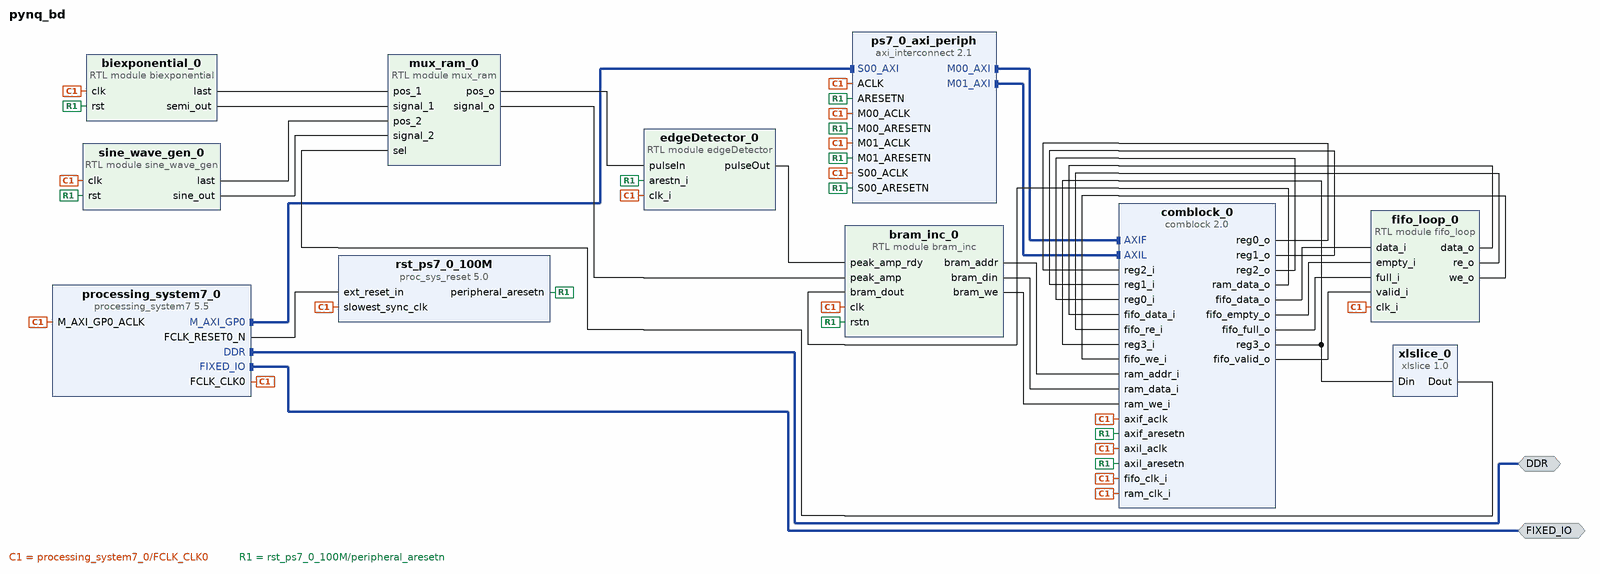
[diagram p0: block diagram of the top level]
# Vivado block design pynq_bd, xc7z020clg400-1, Vivado 2022.2
create_bd_design pynq_bd

create_bd_intf_port -mode Master -vlnv xilinx.com:interface:ddrx_rtl:1.0 DDR
create_bd_intf_port -mode Master -vlnv xilinx.com:display_processing_system7:fixedio_rtl:1.0 FIXED_IO

create_bd_cell -type ip -vlnv xilinx.com:ip:processing_system7:5.5 processing_system7_0
set_property -dict [list \
  CONFIG.PCW_APU_PERIPHERAL_FREQMHZ 650 \
  CONFIG.PCW_CRYSTAL_PERIPHERAL_FREQMHZ 50 \
  CONFIG.PCW_ENET0_ENET0_IO {MIO 16 .. 27} \
  CONFIG.PCW_ENET0_GRP_MDIO_ENABLE 1 \
  CONFIG.PCW_ENET0_GRP_MDIO_IO {MIO 52 .. 53} \
  CONFIG.PCW_ENET0_PERIPHERAL_ENABLE 1 \
  CONFIG.PCW_ENET0_RESET_ENABLE 1 \
  CONFIG.PCW_ENET0_RESET_IO {MIO 9} \
  CONFIG.PCW_ENET_RESET_ENABLE 1 \
  CONFIG.PCW_ENET_RESET_SELECT {Share reset pin} \
  CONFIG.PCW_FPGA0_PERIPHERAL_FREQMHZ 100 \
  CONFIG.PCW_FPGA1_PERIPHERAL_FREQMHZ 50 \
  CONFIG.PCW_GPIO_MIO_GPIO_ENABLE 1 \
  CONFIG.PCW_GPIO_MIO_GPIO_IO MIO \
  CONFIG.PCW_I2C_RESET_ENABLE 1 \
  CONFIG.PCW_M_AXI_GP0_FREQMHZ 10 \
  CONFIG.PCW_PERIPHERAL_BOARD_PRESET part0 \
  CONFIG.PCW_PRESET_BANK1_VOLTAGE {LVCMOS 1.8V} \
  CONFIG.PCW_QSPI_GRP_FBCLK_ENABLE 1 \
  CONFIG.PCW_QSPI_GRP_FBCLK_IO {MIO 8} \
  CONFIG.PCW_QSPI_GRP_SINGLE_SS_ENABLE 1 \
  CONFIG.PCW_QSPI_GRP_SINGLE_SS_IO {MIO 1 .. 6} \
  CONFIG.PCW_QSPI_PERIPHERAL_ENABLE 1 \
  CONFIG.PCW_QSPI_QSPI_IO {MIO 1 .. 6} \
  CONFIG.PCW_SD0_GRP_CD_ENABLE 1 \
  CONFIG.PCW_SD0_GRP_CD_IO {MIO 47} \
  CONFIG.PCW_SD0_GRP_WP_ENABLE 0 \
  CONFIG.PCW_SD0_PERIPHERAL_ENABLE 1 \
  CONFIG.PCW_SD0_SD0_IO {MIO 40 .. 45} \
  CONFIG.PCW_SDIO_PERIPHERAL_FREQMHZ 50 \
  CONFIG.PCW_SINGLE_QSPI_DATA_MODE x4 \
  CONFIG.PCW_UART0_PERIPHERAL_ENABLE 1 \
  CONFIG.PCW_UART0_UART0_IO {MIO 14 .. 15} \
  CONFIG.PCW_UART1_PERIPHERAL_ENABLE 0 \
  CONFIG.PCW_UART_PERIPHERAL_FREQMHZ 100 \
  CONFIG.PCW_UIPARAM_DDR_BUS_WIDTH {16 Bit} \
  CONFIG.PCW_UIPARAM_DDR_FREQ_MHZ 525 \
  CONFIG.PCW_UIPARAM_DDR_PARTNO {MT41J256M16 RE-125} \
  CONFIG.PCW_USB0_PERIPHERAL_ENABLE 1 \
  CONFIG.PCW_USB0_RESET_ENABLE 1 \
  CONFIG.PCW_USB0_RESET_IO {MIO 46} \
  CONFIG.PCW_USB0_USB0_IO {MIO 28 .. 39} \
  CONFIG.PCW_USB_RESET_ENABLE 1 \
  CONFIG.PCW_USB_RESET_SELECT {Share reset pin} \
] [get_bd_cells processing_system7_0]
# 486 more settings of processing_system7_0 are not shown: defaults, MIO pin electricals, DDR timing, and values the tool derives
create_bd_cell -type ip -vlnv www.ictp.it:user:comblock:2.0 comblock_0
set_property -dict [list \
  CONFIG.DRAM_IO_AWIDTH 11 \
  CONFIG.DRAM_IO_DEPTH 1024 \
  CONFIG.DRAM_IO_DWIDTH 32 \
  CONFIG.DRAM_IO_ENA true \
  CONFIG.FIFO_IN_DEPTH 64 \
  CONFIG.FIFO_IN_DWIDTH 32 \
  CONFIG.FIFO_OUT_DEPTH 64 \
  CONFIG.FIFO_OUT_DWIDTH 32 \
  CONFIG.FIFO_OUT_ENA true \
  CONFIG.REGS_IN_DEPTH 4 \
  CONFIG.REGS_OUT_DEPTH 4 \
] [get_bd_cells comblock_0]
create_bd_cell -type ip -vlnv xilinx.com:ip:axi_interconnect:2.1 ps7_0_axi_periph
create_bd_cell -type ip -vlnv xilinx.com:ip:proc_sys_reset:5.0 rst_ps7_0_100M
create_bd_cell -type module -reference fifo_loop fifo_loop_0
create_bd_cell -type ip -vlnv xilinx.com:ip:xlslice:1.0 xlslice_0
set_property -dict {CONFIG.DIN_FROM 1} [get_bd_cells xlslice_0]
create_bd_cell -type module -reference bram_inc bram_inc_0
set_property -dict {CONFIG.BRAM_ADDRESS_SIZE 11} [get_bd_cells bram_inc_0]
create_bd_cell -type module -reference mux_ram mux_ram_0
create_bd_cell -type module -reference edgeDetector edgeDetector_0
create_bd_cell -type module -reference biexponential biexponential_0
create_bd_cell -type module -reference sine_wave_gen sine_wave_gen_0

# ---- connections ----

connect_bd_intf_net [get_bd_intf_ports DDR] [get_bd_intf_pins processing_system7_0/DDR]
connect_bd_intf_net [get_bd_intf_ports FIXED_IO] [get_bd_intf_pins processing_system7_0/FIXED_IO]
connect_bd_intf_net [get_bd_intf_pins processing_system7_0/M_AXI_GP0] [get_bd_intf_pins ps7_0_axi_periph/S00_AXI]
connect_bd_intf_net [get_bd_intf_pins ps7_0_axi_periph/M00_AXI] [get_bd_intf_pins comblock_0/AXIF]
connect_bd_intf_net [get_bd_intf_pins ps7_0_axi_periph/M01_AXI] [get_bd_intf_pins comblock_0/AXIL]
connect_bd_net [get_bd_pins biexponential_0/last] [get_bd_pins mux_ram_0/pos_1]
connect_bd_net [get_bd_pins biexponential_0/semi_out] [get_bd_pins mux_ram_0/signal_1]
connect_bd_net [get_bd_pins bram_inc_0/bram_addr] [get_bd_pins comblock_0/ram_addr_i]
connect_bd_net [get_bd_pins bram_inc_0/bram_din] [get_bd_pins comblock_0/ram_data_i]
connect_bd_net [get_bd_pins bram_inc_0/bram_we] [get_bd_pins comblock_0/ram_we_i]
connect_bd_net [get_bd_pins comblock_0/fifo_data_o] [get_bd_pins fifo_loop_0/data_i]
connect_bd_net [get_bd_pins comblock_0/fifo_empty_o] [get_bd_pins fifo_loop_0/empty_i]
connect_bd_net [get_bd_pins comblock_0/fifo_full_o] [get_bd_pins fifo_loop_0/full_i]
connect_bd_net [get_bd_pins comblock_0/fifo_valid_o] [get_bd_pins fifo_loop_0/valid_i]
connect_bd_net [get_bd_pins comblock_0/ram_data_o] [get_bd_pins bram_inc_0/bram_dout]
connect_bd_net [get_bd_pins comblock_0/reg0_o] [get_bd_pins comblock_0/reg2_i]
connect_bd_net [get_bd_pins comblock_0/reg1_o] [get_bd_pins comblock_0/reg1_i]
connect_bd_net [get_bd_pins comblock_0/reg2_o] [get_bd_pins comblock_0/reg0_i]
connect_bd_net [get_bd_pins comblock_0/reg3_o] [get_bd_pins xlslice_0/Din] [get_bd_pins comblock_0/reg3_i]
connect_bd_net [get_bd_pins edgeDetector_0/pulseOut] [get_bd_pins bram_inc_0/peak_amp_rdy]
connect_bd_net [get_bd_pins fifo_loop_0/data_o] [get_bd_pins comblock_0/fifo_data_i]
connect_bd_net [get_bd_pins fifo_loop_0/re_o] [get_bd_pins comblock_0/fifo_re_i]
connect_bd_net [get_bd_pins fifo_loop_0/we_o] [get_bd_pins comblock_0/fifo_we_i]
connect_bd_net [get_bd_pins mux_ram_0/pos_o] [get_bd_pins edgeDetector_0/pulseIn]
connect_bd_net [get_bd_pins mux_ram_0/signal_o] [get_bd_pins bram_inc_0/peak_amp]
connect_bd_net [get_bd_pins processing_system7_0/FCLK_CLK0] \
  [get_bd_pins processing_system7_0/M_AXI_GP0_ACLK] [get_bd_pins ps7_0_axi_periph/ACLK] \
  [get_bd_pins ps7_0_axi_periph/S00_ACLK] [get_bd_pins rst_ps7_0_100M/slowest_sync_clk] [get_bd_pins comblock_0/axif_aclk] \
  [get_bd_pins ps7_0_axi_periph/M00_ACLK] [get_bd_pins comblock_0/axil_aclk] [get_bd_pins ps7_0_axi_periph/M01_ACLK] \
  [get_bd_pins comblock_0/ram_clk_i] [get_bd_pins comblock_0/fifo_clk_i] [get_bd_pins fifo_loop_0/clk_i] \
  [get_bd_pins bram_inc_0/clk] [get_bd_pins edgeDetector_0/clk_i] [get_bd_pins biexponential_0/clk] \
  [get_bd_pins sine_wave_gen_0/clk]
connect_bd_net [get_bd_pins processing_system7_0/FCLK_RESET0_N] [get_bd_pins rst_ps7_0_100M/ext_reset_in]
connect_bd_net [get_bd_pins rst_ps7_0_100M/peripheral_aresetn] \
  [get_bd_pins ps7_0_axi_periph/S00_ARESETN] [get_bd_pins comblock_0/axif_aresetn] [get_bd_pins ps7_0_axi_periph/M00_ARESETN] \
  [get_bd_pins ps7_0_axi_periph/ARESETN] [get_bd_pins comblock_0/axil_aresetn] [get_bd_pins ps7_0_axi_periph/M01_ARESETN] \
  [get_bd_pins bram_inc_0/rstn] [get_bd_pins edgeDetector_0/arestn_i] [get_bd_pins biexponential_0/rst] \
  [get_bd_pins sine_wave_gen_0/rst]
connect_bd_net [get_bd_pins sine_wave_gen_0/last] [get_bd_pins mux_ram_0/pos_2]
connect_bd_net [get_bd_pins sine_wave_gen_0/sine_out] [get_bd_pins mux_ram_0/signal_2]
connect_bd_net [get_bd_pins xlslice_0/Dout] [get_bd_pins mux_ram_0/sel]
set_property PFM.AXI_PORT {M_AXI_GP1 {memport "M_AXI_GP" sptag "" memory "" is_range "false"} S_AXI_HP0 {memport "S_AXI_HP" sptag "" memory "" is_range "false"}} [get_bd_cells processing_system7_0]
set_property PFM.CLOCK {FCLK_CLK0 {id "0" is_default "true" proc_sys_reset "/rst_ps7_0_100M" status "fixed" freq_hz "100000000"}} [get_bd_cells processing_system7_0]

# ---- address map ----
assign_bd_address -offset 0x43C00000 -range 256K -target_address_space [get_bd_addr_spaces processing_system7_0/Data] [get_bd_addr_segs comblock_0/AXIF/AXIF]
assign_bd_address -offset 0x43C40000 -range 64K -target_address_space [get_bd_addr_spaces processing_system7_0/Data] [get_bd_addr_segs comblock_0/AXIL/AXIL]

validate_bd_design
save_bd_design
